# EAGLE design TSL2561_5V_REV-A (EAGLE 6.3)
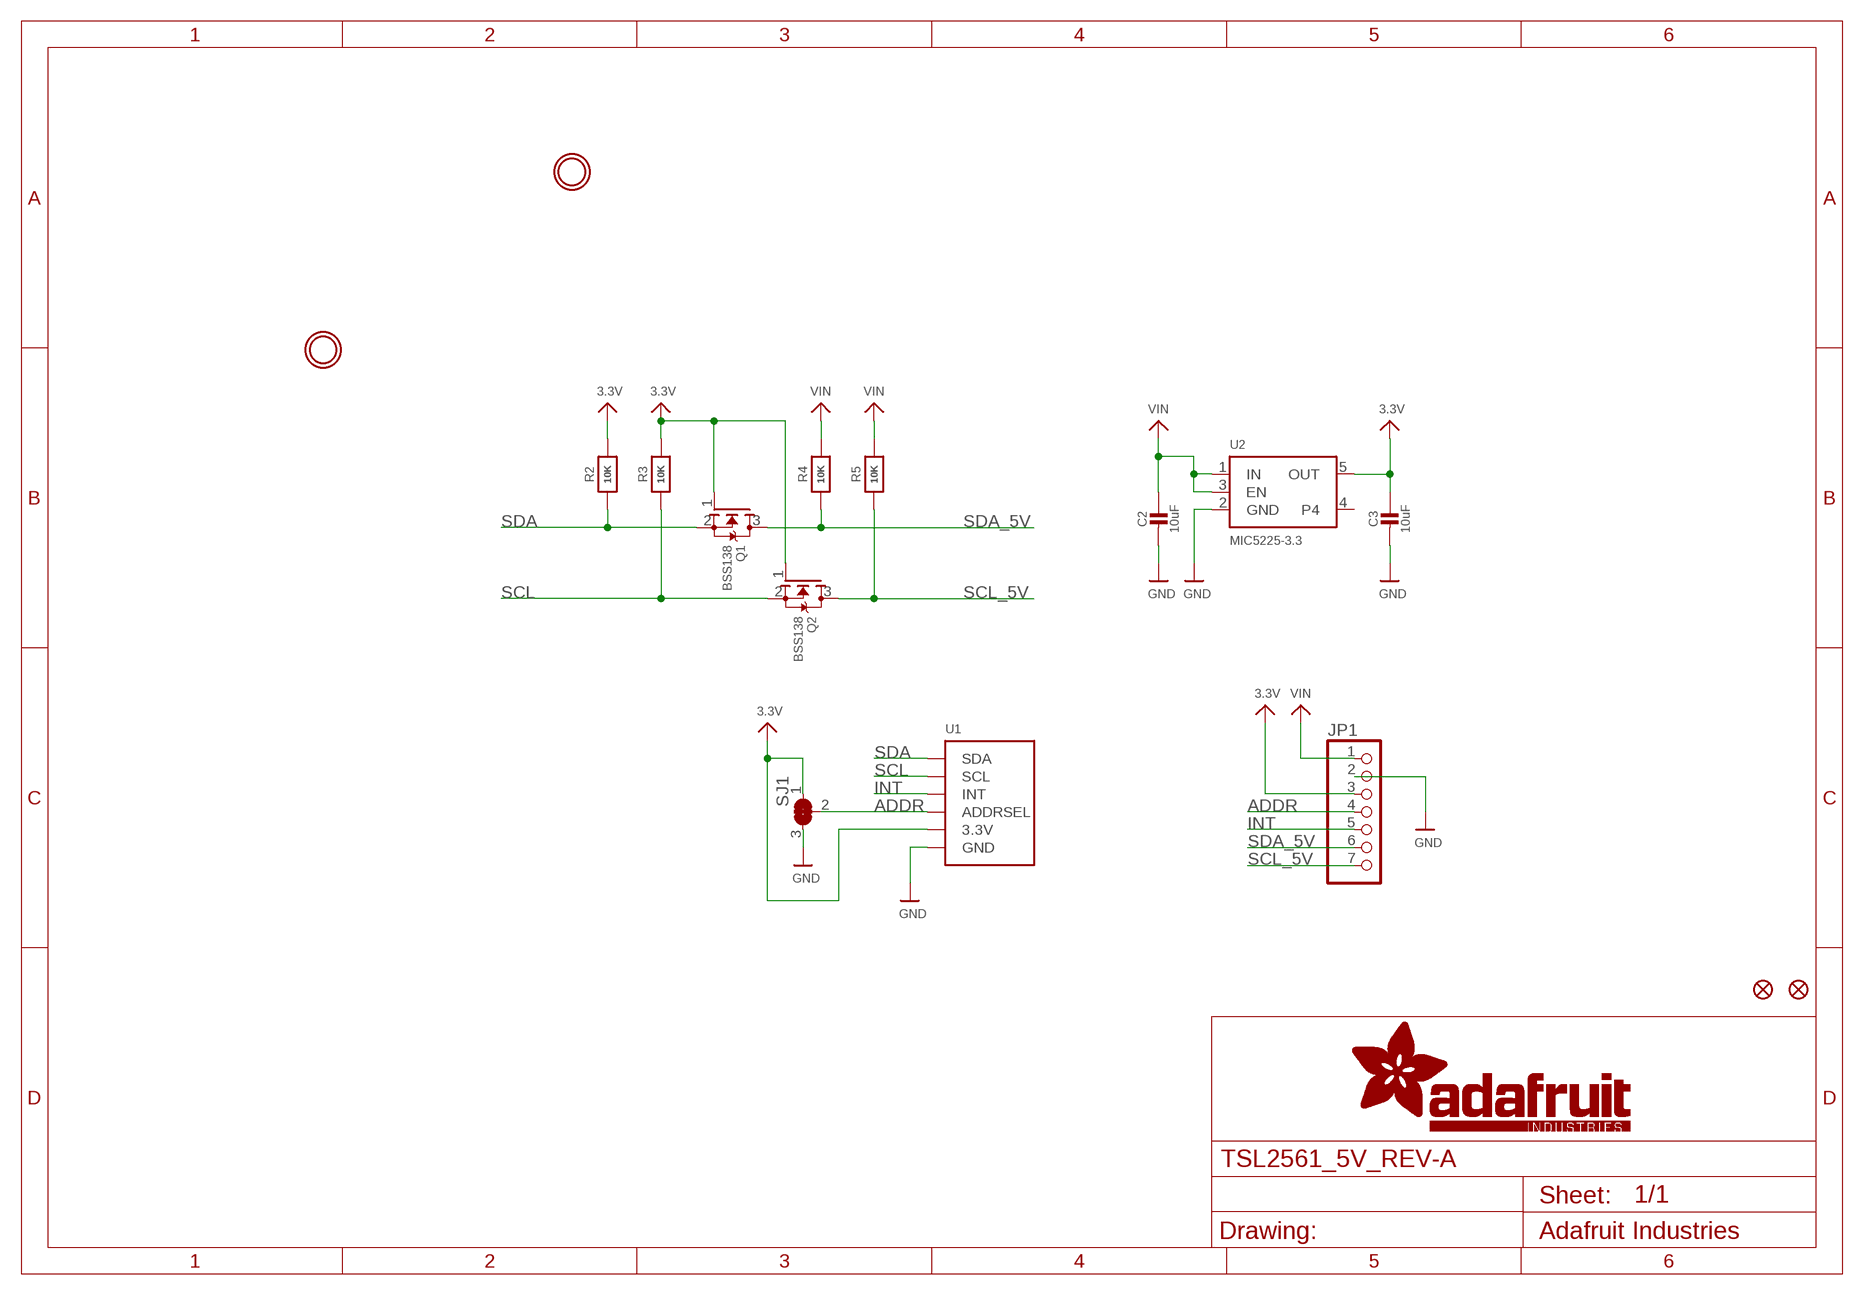
[diagram p0: schematic, sheet 1]

## Parts
C2  10uF  CAP_CERAMIC0805-NOOUTLINE  [0805-NO]
C3  10uF  CAP_CERAMIC0805-NOOUTLINE  [0805-NO]
FID1  FIDUCIAL""  [FIDUCIAL_1MM]
FID2  FIDUCIAL""  [FIDUCIAL_1MM]
JP1  HEADER-1X7THICKER  [1X07_ROUND_76]
Q1  BSS138  MOSFET-NWIDE  [SOT23-WIDE]
Q2  BSS138  MOSFET-NWIDE  [SOT23-WIDE]
R2  10K  RESISTOR0805_NOOUTLINE  [0805-NO]
R3  10K  RESISTOR0805_NOOUTLINE  [0805-NO]
R4  10K  RESISTOR0805_NOOUTLINE  [0805-NO]
R5  10K  RESISTOR0805_NOOUTLINE  [0805-NO]
SJ1  SOLDERJUMPER_2WAY  [SOLDERJUMPER_2WAY_OPEN_NOPASTE]
U1  LIGHT_TSL2561  [TSL2561_FN]
U2  MIC5225-3.3  VREG_SOT23-5  [SOT23-5]
U$18  MOUNTINGHOLE2.5  [MOUNTINGHOLE_2.5_PLATED]
U$19  MOUNTINGHOLE2.5  [MOUNTINGHOLE_2.5_PLATED]

## Nets
3.3V: C3.1 JP1.3 Q1.1(G) Q2.1(G) R2.2 R3.2 SJ1.1 U1.VDD(3.3V) U2.5(OUT)
ADDR: JP1.4 SJ1.2 U1.ADR(ADDRSEL)
GND: C2.2 C3.2 JP1.2 SJ1.3 U1.VSS(GND) U2.2(GND)
INT: JP1.5 U1.INT
SCL: Q2.2(S) R3.1 U1.CLK(SCL)
SCL_5V: JP1.7 Q2.3(D) R5.1
SDA: Q1.2(S) R2.1 U1.DATA(SDA)
SDA_5V: JP1.6 Q1.3(D) R4.1
VIN: C2.1 JP1.1 R4.2 R5.2 U2.1(IN) U2.3(EN)
Unconnected: U2.4

## Library data of the parts
C2 C3 = microbuilder:CAP_CERAMIC: Ceramic Capacitors For new designs, use the packages preceded by an '_' character since they are more reliable: The following footprints should be used on most boards: _0402 - Standard footprint for regular board layouts _0603 - Standard footprint for regular board layouts _0805 - Standard footprint for regular board layouts _1206 - Standard footprint for regular board layouts For extremely tight-pitch boards where space is at a premium, the following 'micro-pitch' footprints can be used (smaller pads, no silkscreen outline, etc.): _0402MP - Micro-pitch footprint for very dense/compact boards _0603MP - Micro-pitch footprint for very dense/compact boards _0805MP - Micro-pitch footprint for very dense/compact boards _1206MP - Micro-pitch footprint for very dense/compact boards
FID1 FID2 = microbuilder:FIDUCIAL: Fiducial Alignment Points Various fiducial points for machine vision alignment.; BOM: EXCLUDE
JP1 = microbuilder:HEADER-1X7: PIN HEADER
Q1 Q2 = microbuilder:MOSFET-N: N-Channel Mosfet LEGEND VDS: Voltage Drain-Source ID: Drain Current RDS(ON): Drain-Source On-State Resistance VGS(TH): Gate-Source Threshold Voltage CISS: Drain-Source Input Capacitance SOT-23 Name VDS ID RDS(ON) VGS(TH) CISS Order Number 2N7002E 60V 260mA 2.5 Ohm 2.5V @ 250uA 26.7pF @ 25V 2N7002ET1GOSTR-ND BSH103 30V 850mA 400 mOhm 400mV @ 1mA 83pF @ 24V BSH103,235-ND BSS138 60V 320mA 1.6 Ohm 1.5V @ 250uA 50pF @ 10V Mouser: 771-BSS138PW115 DMN2075U-7 20V 4.2A 38 mOhm 1V @ 250 uA 594.3pF @ 10V DMN2075U-7DICT-ND * BSS138 good choice for I2C level-shifting POWERPAK 1212-8 Name VDS ID RDS(ON) VGS(TH) CISS Order Number Si7308DN 60V 6A 58 mOhm 3V @ 250uA 665pF @ 15V SI7308DN-T1-E3CT-ND
R2-R5 = microbuilder:RESISTOR: Resistors For new designs, use the packages preceded by an '_' character since they are more reliable: The following footprints should be used on most boards: _0402 - Standard footprint for regular board layouts _0603 - Standard footprint for regular board layouts _0805 - Standard footprint for regular board layouts _1206 - Standard footprint for regular board layouts For extremely tight-pitch boards where space is at a premium, the following 'micro-pitch' footprints can be used (smaller pads, no silkscreen outline, etc.): _0402MP - Micro-pitch footprint for very dense/compact boards _0603MP - Micro-pitch footprint for very dense/compact boards _0805MP - Micro-pitch footprint for very dense/compact boards _1206MP - Micro-pitch footprint for very dense/compact boards
SJ1 = microbuilder:SOLDERJUMPER_2WAY: 2-Way Solder Jumper
U1 = microbuilder:LIGHT_TSL2561: TSL2561 Light-To-Digital Sensor Mouser Part Numbers: CS (obsolete): 856-TSL2561CS DFN (cheapest): 856-TSL2561FN
U2 = microbuilder:VREG_SOT23-5: SOT23-5 Fixed Voltage Regulators Part Current Out V Out V In V Dropout θJA (°C/W) TJ (°C) Digikey Part No. ADP121 150mA 3.3V 3.4-5.5V 0.09V @ 150mA -- -- ADP121-AUJZ33R7CT-ND ADP121 150mA 3.0V 3.1-5.5V 0.09V @ 150mA -- -- ADP121-AUJZ30R7CT-ND ADP122 300mA 3.3V 3.4-5.5V 0.085V @ 300mA -- -- ADP122AUJZ-3.3-R7CT-ND ADP1712 300mA 3.3V 3.5-5.5V 0.17V @ 300mA -- -- ADP1712AUJZ-3.3-R7TR-ND AP7311 (Low Cost) 150mA 3.3V 3.5-6V 0.15V @ 150mA -- -- AP7311-33WG-7DICT-ND LD39015M18R 150mA 1.8V 1.9V-5.5V 0.08V @ 100mA -- -- 497-6977-1-ND LP2985A-33DBVR 150mA 3.3V 3.3-16V 0.28V @ 150mA 206 150 296-18479-1-ND MCP1824T-3302E/OT 300mA 3.3V 3.5V-6V 0.2V @ 300mA -- -- MCP1824T-3302E/OTCT-ND MIC5205-2.5YM5 TR 150mA 2.5V 2.7-16V 0.165V @ 150mA -- -- 576-1257-2-ND MIC5205-3.0YM5 TR 150mA 3.0V 3.2V-16V 0.165V @ 150mA -- -- 576-1258-2-ND MIC5205-3.3YM5 TR 150mA 3.3V 3.5V-16V 0.165V @ 150mA -- -- 576-1259-2-ND TPS780330220 150mA 3.3V+2.2V 3.6-5.5V 250mV Max -- -- 296-23332-1-ND TDA3663/N1,135 100mA 3.3V 3.5-45V 0.18V @ 50mA -- -- 568-5343-1-ND Max operating temp can be calculated using θJA, TJ (max junction temperature), and power in watts. Set the "Maximum Ambient Temperature" until it reaches TJ ("Max Junction Temperature"), which is the absolute limit for safe use of the regulator: Heat Sink Temperature Calculator <http://www.daycounter.com/Calculators/Heat-Sink-Temperature-Calculator.phtml> For example, With 12V source into a 3.3V LP2985 and a 30mA load, we are dissipating (12V-3.3V) * 0.03A = 0.261W. With a θJA of 206 °C/W, a TJ of 150°C, and 261mW we can safely use the chip without a heat sink up to 75°C (=147.1°C Junction Temperature).
U$18 U$19 = microbuilder:MOUNTINGHOLE: Mounting Hole For #2 screws (0.086"/2.18mm width, 0.094"/2.4mm hole) use 2.5mm; BOM: EXCLUDE

## Board
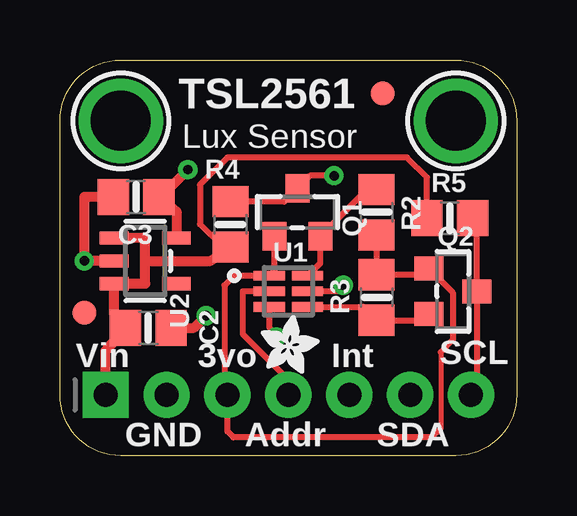
[diagram p1: board, top side]
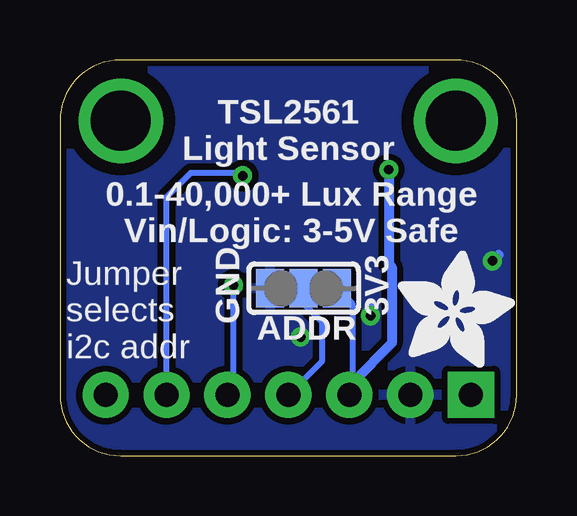
[diagram p2: board, bottom side, seen from below]

Size 19.05 x 16.51 mm. Coordinates in mm from the lower left corner, seen from the top.
Outline: 16.51,0 2.54,0 arc-90 0,2.54 0,13.97 arc-90 2.54,16.51 16.51,16.51 arc-90 19.05,13.97 19.05,2.54 arc-90 16.51,0
Copper layers (1*16): Top 0.035mm / dielectric 1.5mm / Bottom 0.035mm
Design rules "adafruit": minimum track width 8mil, minimum drill 15.5mil, track to track 8mil, track to pad 8mil, pad to pad 8mil, via to via 8mil, smd to smd 8mil, copper to edge 10mil, drill to drill 8mil, minimum pad ring 10mil, minimum via ring 8mil, stop-mask expansion 2mil, vias tented up to drill 20mil, thermal gap 10mil

### Footprints (pad centres in the part's own frame; a part is rotated, then mirrored left to right if it is on the bottom)
0805-NO = smd 1.3 x 1.5: 1 -0.95,0; 2 0.95,0
FIDUCIAL_1MM = smd 1 x 1: 1 0,0
1X07_ROUND_76 = drill 1 pad 1.93 square: 1 -7.62,0 | drill 1 pad 1.93: 2 -5.08,0; 3 -2.54,0; 4 0,0; 5 2.54,0; 6 5.08,0; 7 7.62,0
SOT23-WIDE = smd 1 x 1.2: 1 -0.95,-1; 2 0.95,-1; 3 0,1
SOLDERJUMPER_2WAY_OPEN_NOPASTE = smd 1.168 x 1.6: 1 -1.397,0; 2 0,0; 3 1.397,0
TSL2561_FN = smd 1.3 x 0.4: ADR -0.8,0; CLK 0.8,-0.65; DATA 0.8,0.65; INT 0.8,0; VDD -0.8,0.65; VSS -0.8,-0.65
SOT23-5 = smd 0.55 x 1.2: 1 -0.95,-1.3; 2 0,-1.3; 3 0.95,-1.3; 4 0.95,1.3; 5 -0.95,1.3
MOUNTINGHOLE_2.5_PLATED = drill 2.5 pad 3.2: P$1 0,0

### Placement (x,y rotation side)
C2  3.68,5.33 0 top
C3  3.17,10.79 180 top
FID1  13.46,15.11 0 top
FID2  1.02,5.97 0 top
JP1  9.53,2.54 0 top
Q1  9.91,10.16 0 top
Q2  16.38,6.86 270 top
R2  13.21,10.16 270 top
R3  13.21,6.6 90 top
R4  7.11,9.65 270 top
R5  16.26,9.91 180 top
SJ1  8.89,6.99 180 bottom
U1  9.53,6.86 0 top
U2  3.56,8.13 270 top
U$15  [ADAFRUIT_2.5MM]  8.38,3.43 0 top
U$18  2.54,13.97 0 top
U$19  16.51,13.97 0 top
U$20  [ADAFRUIT_5MM]  4.95,3.68 0 bottom

### Tracks (layer width: path | path; a pad name or v marks a point on that pad's centre or on a via)
3.3V  (via drill 0.39)
  Top 0.203: 15.88,4.32 15.88,1.14
  Top 0.254: Q1.1 8.96,7.74 U1.VDD 7.25,7.51 6.86,7.11 6.86,2.67 JP1.3 6.99,1.02 7.24,0.76 15.49,0.76 15.88,1.14 | R2.2 R3.2 15.13,7.55 Q2.1 16.38,6.81 16.38,4.83 15.88,4.32
  Top 0.406: U2.5 4.86,10.19 C3.1 4.32,10.92 v5.33,11.94
  Bottom 0.254: SJ1.1 6.86,6.35 6.86,3.05
  Bottom 0.406: v5.33,11.94 5.33,8 5.21,7.87 5.21,4.7 6.86,3.05 6.86,2.67 JP1.3
ADDR
  Top 0.254: U1.ADR 7.62,6.86 7.62,5.08 9.53,3.17 JP1.4
  Bottom 0.254: SJ1.2 8.89,6.35 8.13,5.59 8.13,3.94 JP1.4 9.65,2.67
GND  (via drill 0.39)
  Top 0.254: U1.VSS 8.72,5.37 v9.02,4.95
  Top 0.406: C2.2 5.59,5.33 v6.1,5.84 | U2.2 v1.02,8.13 1.02,10.79 C3.2
  Bottom 0.254: v9.02,4.95 9.27,4.95
  Bottom 0.406: v6.1,5.84 6.1,6.35 | v1.02,8.13 0.76,8.38
  pour Bottom (isolate 0.254): 0,16.51 20.32,16.51 20.32,-0.13 0,-0.13
INT  (via drill 0.39)
  Top 0.254: v11.81,7.11 11.56,6.86 U1.INT
  Bottom 0.254: JP1.5 11.81,2.79 v11.81,7.11
SCL
  Top 0.254: U1.CLK 12.65,6.21 R3.1 15.13,5.65 Q2.2
SCL_5V
  Top 0.254: R5.1 17.38,9.73 Q2.3 17.38,2.78 JP1.7
SDA
  Top 0.254: U1.DATA 10.86,8.04 Q1.2 12.81,11.11 R2.1
SDA_5V  (via drill 0.39)
  Top 0.254: R4.1 9.35,10.6 Q1.3 10.43,11.68 v11.43,11.68
  Bottom 0.254: JP1.6 14.61,10.79 13.59,11.81 11.56,11.81 v11.43,11.68
VIN
  Top 0.254: R5.2 15.31,11.62 14.48,12.45 6.99,12.45 5.84,11.3 5.84,9.65 6.73,8.76 7.05,8.76 R4.2
  Top 0.406: JP1.1 1.91,4.38 C2.1 2.26,5.94 U2.3 3.56,7.18 3.56,8.13 | 3.56,8.13 3.56,9.08 U2.1 | 3.56,8.13 6.28,8.13 R4.2

### Text on the board
tPlace: TSL2561 | Lux Sensor | Vin | 3vo | Int | SCL | GND | Addr | SDA
bPlace: TSL2561 / Light Sensor | 0.1-40,000+ Lux Range / Vin/Logic: 3-5V Safe | 3V3 | GND | ADDR | Jumper / selects / i2c addr